# Altium schematic sheet Peripherals.SchDoc
size B; SheetNumber: 4; SheetTotal: 6
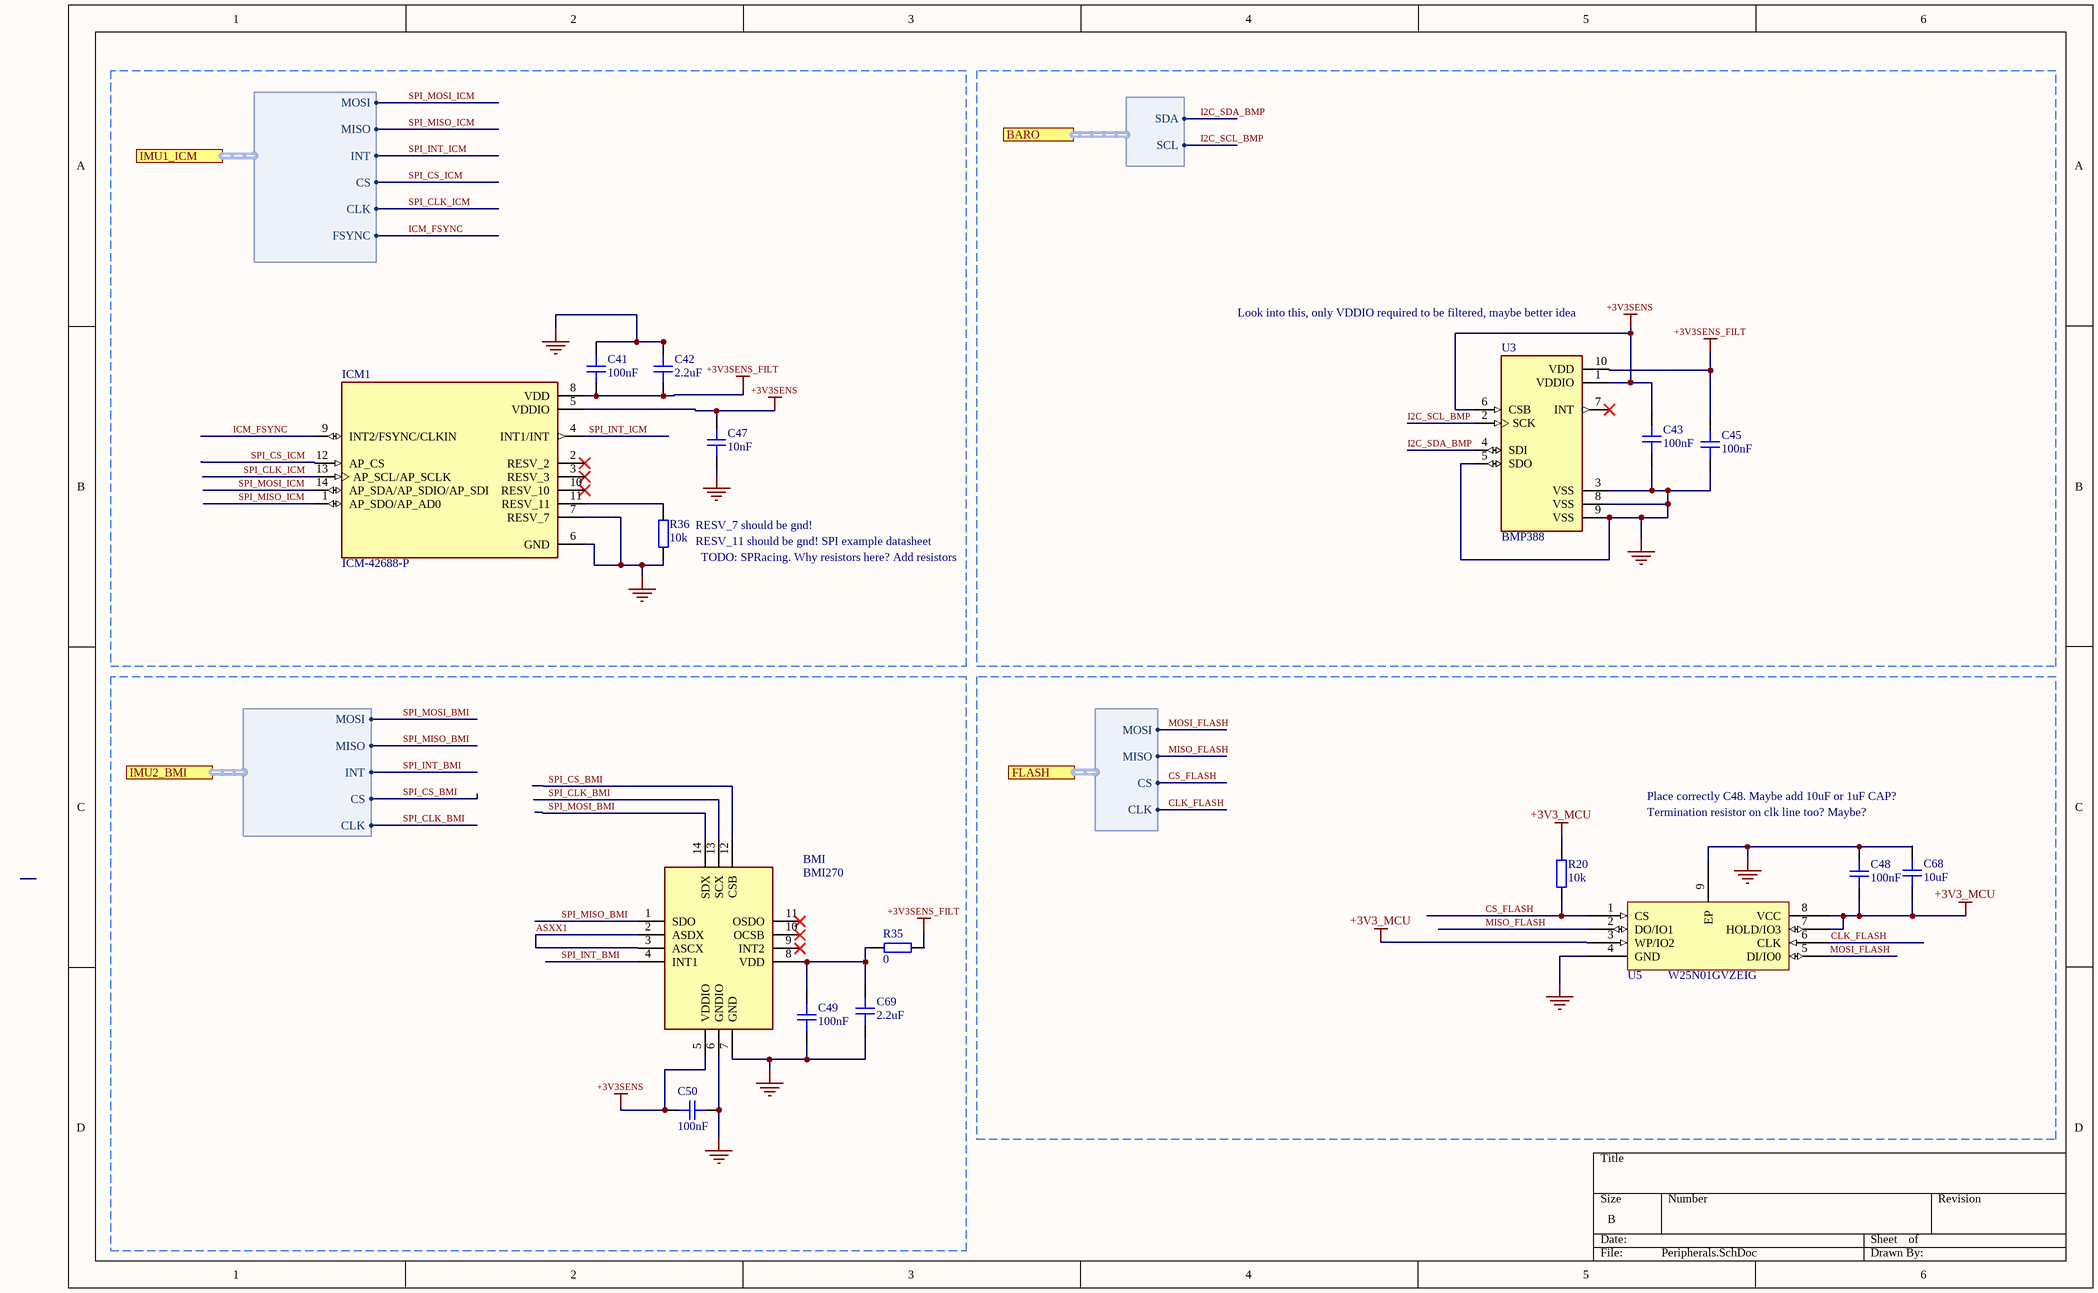
[diagram p0: Peripherals.SchDoc]

## Parts
BMI  BMI270  [BMI270]
C41  100nF  [CAP_0201]
C42  2.2uF  [CAP_0402]
C43  100nF  [CAP_0201]
C45  100nF  [CAP_0201]
C47  10nF  [CAP_0201]
C48  100nF  [CAP_0201]
C49  100nF  [CAP_0201]
C50  100nF  [CAP_0201]
C68  10uF  [CAP_0402]
C69  2.2uF  [CAP_0402]
ICM1  ICM-42688-P  [ICM-42688-P]
R20  10k  [RES_0201]
R35  0  [RES_0402]
R36  10k  [RES_0201]
U3  BMP388  [PQFN50P200X200X80-10N]
U5  W25N01GVZEIG  [W25N01GVZEIG]

## Ports
BARO (harness I2C3_BARO, see Overview[3C], MCU[8A]), FLASH (harness FLASH, see Overview[3C], MCU[1D]), IMU1_ICM (harness IMU1, see Overview[2C], MCU[1A]), IMU2_BMI (harness IMU, see Overview[2C], MCU[1B])

## Harnesses
IMU: CLK, CS, INT, MISO, MOSI
IMU1: CLK, CS, INT, MISO, MOSI, FSYNC
I2C3_BARO: SCL, SDA
FLASH: CLK, CS, MISO, MOSI

## Nets
+3V3_MCU: C48.1 C68.1 R20.2 U5.3(WP/IO2) U5.7(HOLD/IO3) U5.8(VCC)
+3V3SENS: BMI.5(VDDIO) C43.2 C47.2 C50.2 ICM1.5(VDDIO) U3.1(VDDIO) U3.6(CSB)
+3V3SENS_FILT: C41.1 C42.1 C45.2 ICM1.8(VDD) R35.2 U3.10(VDD)
GND: BMI.6(GNDIO) BMI.7(GND) C41.2 C42.2 C43.1 C45.1 C47.1 C48.2 C49.1 C50.1 C68.2 C69.1 ICM1.6(GND) ICM1.7(RESV_7) R36.1 U3.3(VSS) U3.5(SDO) U3.8(VSS) U3.9(VSS) U5.4(GND) U5.9(EP)
ASXX1: BMI.2(ASDX) BMI.3(ASCX)
CLK_FLASH: U5.6(CLK) ; port FLASH.CLK
CS_FLASH: R20.1 U5.1(CS) ; port FLASH.CS
I2C_SCL_BMP: U3.2(SCK) ; port BARO.SCL
I2C_SDA_BMP: U3.4(SDI) ; port BARO.SDA
ICM_FSYNC: ICM1.9(INT2/FSYNC/CLKIN) ; port IMU1_ICM.FSYNC
MISO_FLASH: U5.2(DO/IO1) ; port FLASH.MISO
MOSI_FLASH: U5.5(DI/IO0) ; port FLASH.MOSI
SPI_CLK_BMI: BMI.13(SCX) ; port IMU2_BMI.CLK
SPI_CLK_ICM: ICM1.13(AP_SCL/AP_SCLK) ; port IMU1_ICM.CLK
SPI_CS_BMI: BMI.12(CSB) ; port IMU2_BMI.CS
SPI_CS_ICM: ICM1.12(AP_CS) ; port IMU1_ICM.CS
SPI_INT_BMI: BMI.4(INT1) ; port IMU2_BMI.INT
SPI_INT_ICM: ICM1.4(INT1/INT) ; port IMU1_ICM.INT
SPI_MISO_BMI: BMI.1(SDO) ; port IMU2_BMI.MISO
SPI_MISO_ICM: ICM1.1(AP_SDO/AP_AD0) ; port IMU1_ICM.MISO
SPI_MOSI_BMI: BMI.14(SDX) ; port IMU2_BMI.MOSI
SPI_MOSI_ICM: ICM1.14(AP_SDA/AP_SDIO/AP_SDI) ; port IMU1_ICM.MOSI
NetBMI_8: BMI.8(VDD) C49.2 C69.2 R35.1
NetICM1_11: ICM1.11(RESV_11) R36.2

Not connected (* = marked no-connect by the designer): BMI 9(INT2)* 10(OCSB)* 11(OSDO)*; ICM1 2(RESV_2)* 3(RESV_3)* 10(RESV_10)*; U3 7(INT)*

## Notes on the sheet
- (near U3) Look into this, only VDDIO required to be filtered, maybe better idea
- (near R36) RESV_7 should be gnd!
- (near R36) RESV_11 should be gnd! SPI example datasheet
- (near R36) TODO: SPRacing. Why resistors here? Add resistors
- Termination resistor on clk line too? Maybe?
- Place correctly C48. Maybe add 10uF or 1uF CAP?

## Library data of the parts
BMI = BMI270: Integrated Circuit; Manufacturer_Name: BOSCH; Datasheet Link: https://www.mouser.de/datasheet/2/783/BST-BMI270-FL000-1530947.pdf; Height: 0.87mm; Manufacturer_Part_Number: BMI270; Mouser Part Number: 262-BMI270; Mouser Price/Stock: https://www.mouser.co.uk/ProductDetail/Bosch-Sensortec/BMI270?qs=u16ybLDytRYIj%252BjQEee88A%3D%3D; Arrow Part Number: BMI270; Arrow Price/Stock: https://www.arrow.com/en/products/bmi270/bosch?region=nac
C41 C43 C45 C47-C50 = CAP_0201: Capacitor SMD 0201; Manufacturer: *; Manufacturer Part Number: *; Distributor Link: *; LCSC: *; Rating: *; Dielectric: *
C42 C68 C69 = CAP_0402: Capacitor SMD 0402; Manufacturer: *; Manufacturer Part Number: *; Distributor Link: *; LCSC: *; Rating: *; Dielectric: *
R20 R36 = RES_0201: Resistor SMD 0201; Manufacturer: *; Manufacturer Part Number: *; Distributor Link: *; LCSC: *
R35 = RES_0402: Resistor SMD 0402; Manufacturer: *; Manufacturer Part Number: *; Distributor Link: *; LCSC: *
U3 = BMP388: P-Sensor SPI I2C 1, 25 Bar SMD; Package: None; Price: None; Value: *; MP: BMP388; Availability: Unavailable
U5 = W25N01GVZEIG: Manufacturer: Windbond Elec; Manufacturer part: W25N01GVZEIG; LCSC part: C88868